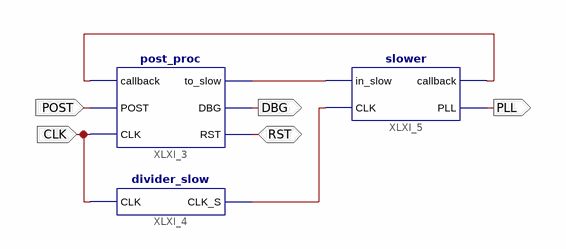
[diagram p0: schematic sheet 1]
// Xilinx ISE schematic overall.sch (xbr) as structural Verilog: 3 symbols, 5 ports
module overall (
  input  CLK,
  input  POST,
  inout  RST,
  output DBG,
  output PLL
);

  wire XLXN_6, XLXN_7, XLXN_11;

  post_proc XLXI_3 (.CLK(CLK), .to_slow(XLXN_6), .DBG(DBG), .RST(RST), .POST(POST), .callback(XLXN_11));
  divider_slow XLXI_4 (.CLK(CLK), .CLK_S(XLXN_7));
  slower XLXI_5 (.CLK(XLXN_7), .in_slow(XLXN_6), .PLL(PLL), .callback(XLXN_11));
endmodule
